# EAGLE design sot-3_breakout (EAGLE 6.4)
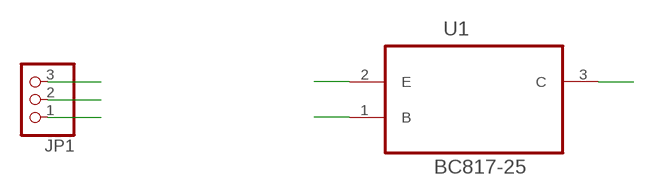
[diagram p0: schematic, sheet 1]

## Parts
JP1  PINHD-1X3  [1X03]
U1  BC817-25  [SOT95P240X97-3N]

## Nets
1: JP1.1 U1.1(B)
2: JP1.2 U1.2(E)
3: JP1.3 U1.3(C)

## Library data of the parts
JP1 = adafruit:PINHD-1X3: PIN HEADER
U1 = Fairchild_By_element14_Batch_1:BC817-25: NPN Epitaxial Silicon Transistor; MPN: BC817-25; OC_FARNELL: 1228216; OC_NEWARK: -; PACKAGE: SOT-3; SUPPLIER: Fairchild

## Board
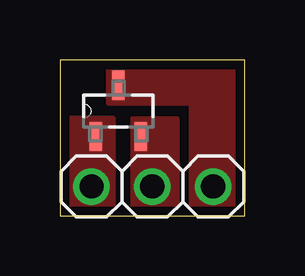
[diagram p1: board, top side]
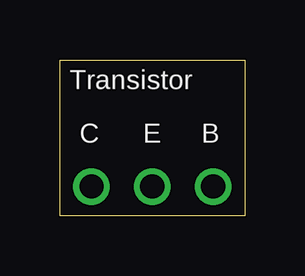
[diagram p2: board, bottom side, seen from below]

Size 7.72 x 6.5 mm. Coordinates in mm from the lower left corner, seen from the top.
Outline: 0,0 7.72,0 7.72,6.5 0,6.5 0,0
Copper layers (1*16): Top 0.035mm / dielectric 1.5mm / Bottom 0.035mm
Design rules "default *": minimum track width 6mil, minimum drill 13mil, track to track 6mil, track to pad 6mil, pad to pad 6mil, via to via 6mil, smd to smd 0mil, copper to edge 15mil, drill to drill 8mil, minimum pad ring 7mil, minimum via ring 7mil, stop-mask expansion 4mil, vias tented up to drill 0mil, thermal gap 10mil

### Footprints (pad centres in the part's own frame; a part is rotated, then mirrored left to right if it is on the bottom)
1X03 = drill 1.016: 1 -2.54,0; 2 0,0; 3 2.54,0
SOT95P240X97-3N = smd 1.219 x 0.533: 1 -1.067,0.94; 2 -1.067,-0.94; 3 1.067,0

### Placement (x,y rotation side)
JP1  3.86,1.22 0 top
U1  2.44,4.37 90 top

### Tracks (layer width: path | path; a pad name or v marks a point on that pad's centre or on a via)
1
  pour Top (no thermals): 1.83,4.06 0.2,4.06 0.2,0.2 2.24,0.2 2.24,4.06
2
  pour Top (no thermals): 3.05,4.06 4.88,4.06 4.88,0.2 3.05,0.2
3
  pour Top (no thermals): 2.03,6.1 7.52,6.1 7.52,0.2 5.49,0.2 5.49,4.67 2.03,4.67

### Text on the board
bPlace: Transistor | B | E | C